# EAGLE schematic keyboard Right (EAGLE 6.6.0)
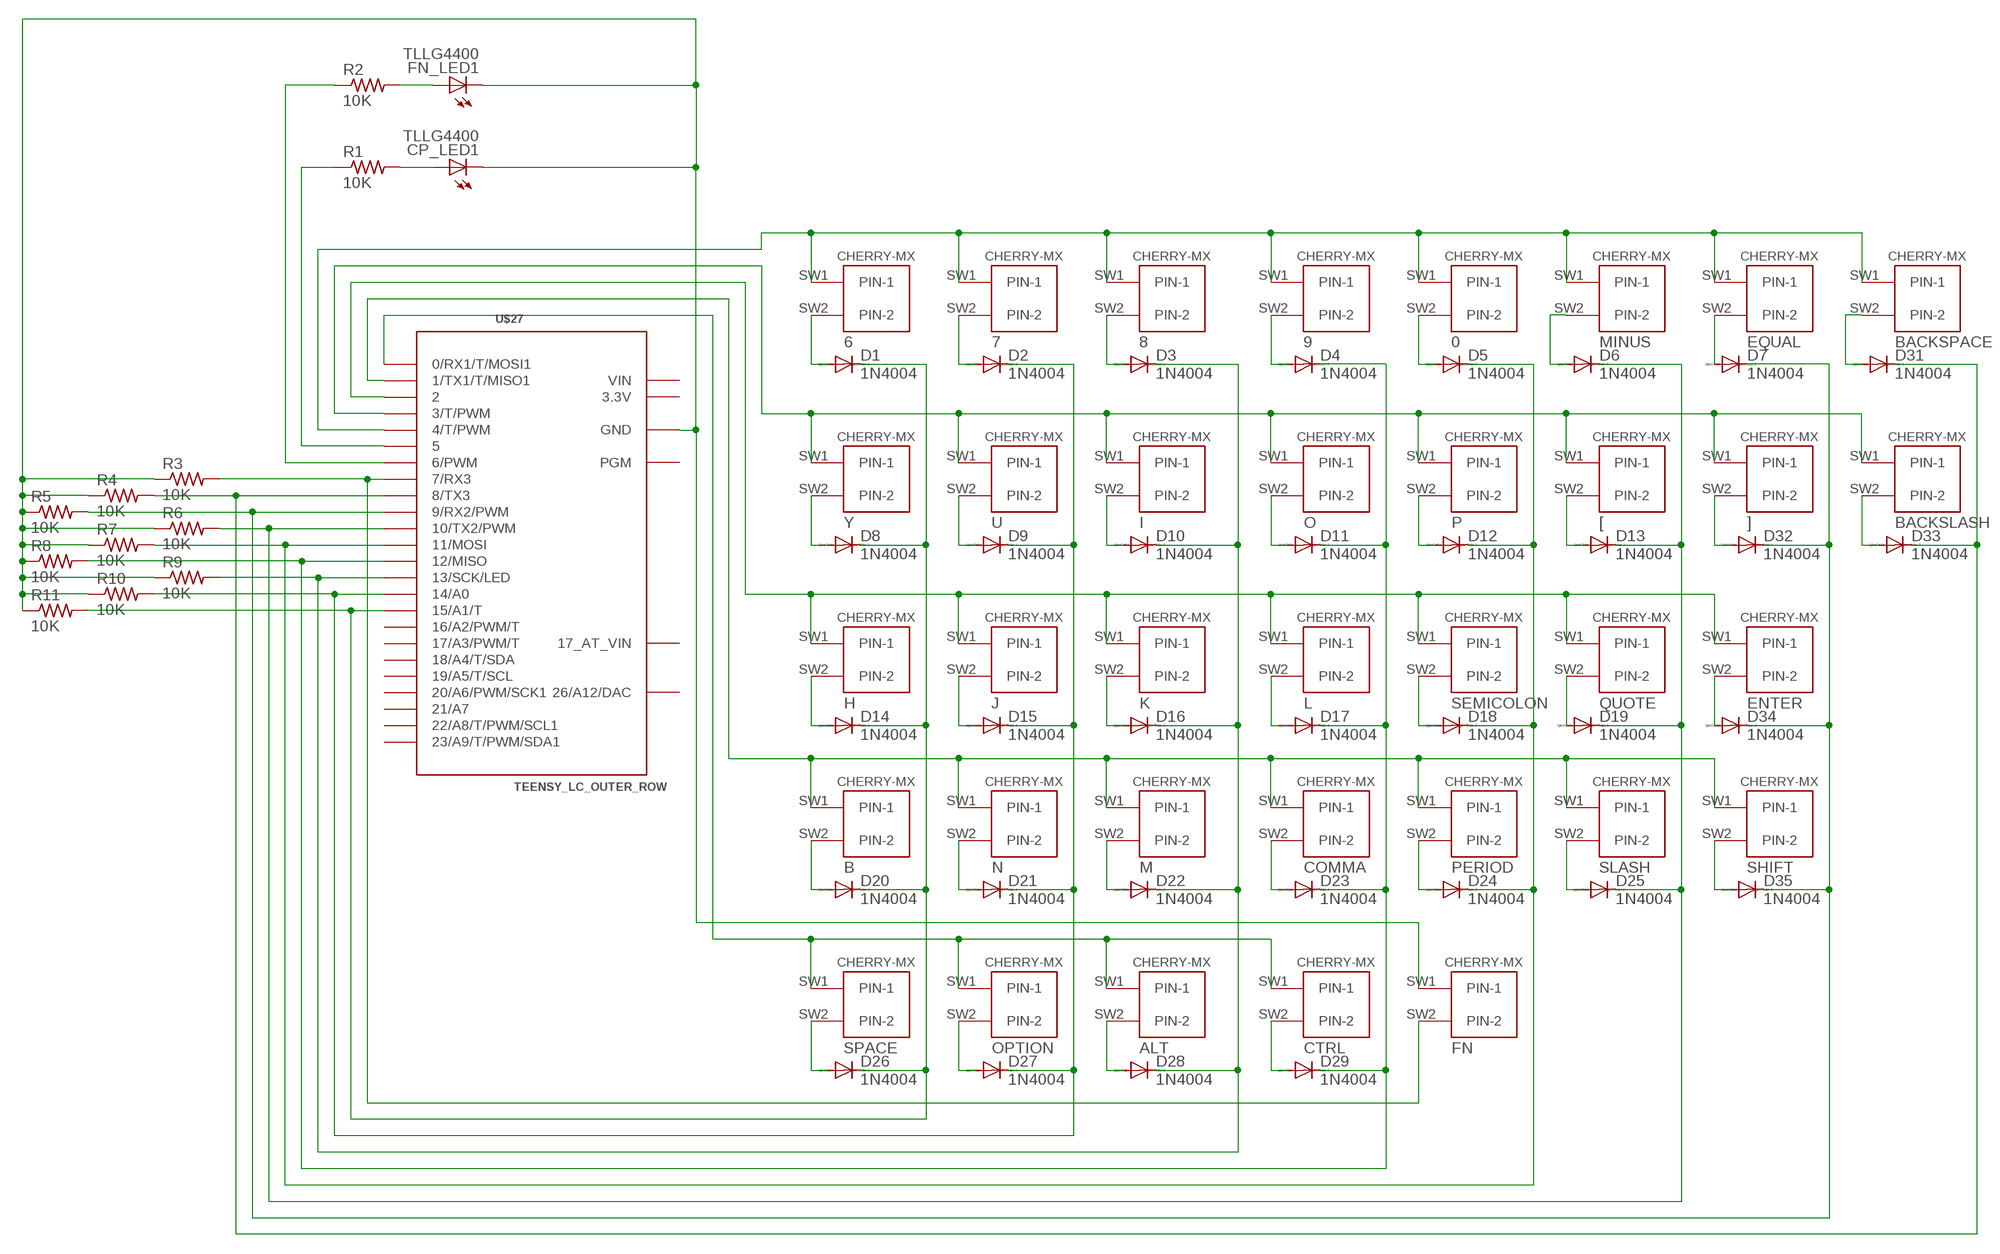
[diagram p0: schematic, sheet 1]

## Parts
0  CHERRY-MX  [CHERRY-MX]
6  CHERRY-MX  [CHERRY-MX]
7  CHERRY-MX  [CHERRY-MX]
8  CHERRY-MX  [CHERRY-MX]
9  CHERRY-MX  [CHERRY-MX]
[  CHERRY-MX  [CHERRY-MX]
]  CHERRY-MX  [CHERRY-MX]
ALT  CHERRY-MX  [CHERRY-MX]
B  CHERRY-MX  [CHERRY-MX]
BACKSLASH  CHERRY-MX  [CHERRY-MX]
BACKSPACE  CHERRY-MX  [CHERRY-MX]
COMMA  CHERRY-MX  [CHERRY-MX]
CP_LED1  TLLG4400  [LED3MM]
CTRL  CHERRY-MX  [CHERRY-MX]
D1  1N4004  [DO41-10]
D2  1N4004  [DO41-10]
D3  1N4004  [DO41-10]
D4  1N4004  [DO41-10]
D5  1N4004  [DO41-10]
D6  1N4004  [DO41-10]
D7  1N4004  [DO41-10]
D8  1N4004  [DO41-10]
D9  1N4004  [DO41-10]
D10  1N4004  [DO41-10]
D11  1N4004  [DO41-10]
D12  1N4004  [DO41-10]
D13  1N4004  [DO41-10]
D14  1N4004  [DO41-10]
D15  1N4004  [DO41-10]
D16  1N4004  [DO41-10]
D17  1N4004  [DO41-10]
D18  1N4004  [DO41-10]
D19  1N4004  [DO41-10]
D20  1N4004  [DO41-10]
D21  1N4004  [DO41-10]
D22  1N4004  [DO41-10]
D23  1N4004  [DO41-10]
D24  1N4004  [DO41-10]
D25  1N4004  [DO41-10]
D26  1N4004  [DO41-10]
D27  1N4004  [DO41-10]
D28  1N4004  [DO41-10]
D29  1N4004  [DO41-10]
D31  1N4004  [DO41-10]
D32  1N4004  [DO41-10]
D33  1N4004  [DO41-10]
D34  1N4004  [DO41-10]
D35  1N4004  [DO41-10]
ENTER  CHERRY-MX  [CHERRY-MX]
EQUAL  CHERRY-MX  [CHERRY-MX]
FN  CHERRY-MX  [CHERRY-MX]
FN_LED1  TLLG4400  [LED3MM]
H  CHERRY-MX  [CHERRY-MX]
I  CHERRY-MX  [CHERRY-MX]
J  CHERRY-MX  [CHERRY-MX]
K  CHERRY-MX  [CHERRY-MX]
L  CHERRY-MX  [CHERRY-MX]
M  CHERRY-MX  [CHERRY-MX]
MINUS  CHERRY-MX  [CHERRY-MX]
N  CHERRY-MX  [CHERRY-MX]
O  CHERRY-MX  [CHERRY-MX]
OPTION  CHERRY-MX  [CHERRY-MX]
P  CHERRY-MX  [CHERRY-MX]
PERIOD  CHERRY-MX  [CHERRY-MX]
QUOTE  CHERRY-MX  [CHERRY-MX]
R1  10K  R-US_0204/7  [0204/7]
R2  10K  R-US_0204/7  [0204/7]
R3  10K  R-US_0204/7  [0204/7]
R4  10K  R-US_0204/7  [0204/7]
R5  10K  R-US_0204/7  [0204/7]
R6  10K  R-US_0204/7  [0204/7]
R7  10K  R-US_0204/7  [0204/7]
R8  10K  R-US_0204/7  [0204/7]
R9  10K  R-US_0204/7  [0204/7]
R10  10K  R-US_0204/7  [0204/7]
R11  10K  R-US_0204/7  [0204/7]
SEMICOLON  CHERRY-MX  [CHERRY-MX]
SHIFT  CHERRY-MX  [CHERRY-MX]
SLASH  CHERRY-MX  [CHERRY-MX]
SPACE  CHERRY-MX  [CHERRY-MX]
U  CHERRY-MX  [CHERRY-MX]
U$27  TEENSY_LC_OUTER_ROW  [TEENSY_3.0-3.2&LC_OUTER_ROW]
Y  CHERRY-MX  [CHERRY-MX]

## Nets
N$1: ALT.SW1(PIN-1) CTRL.SW1(PIN-1) OPTION.SW1(PIN-1) SPACE.SW1(PIN-1) U$27.0(0/RX1/T/MOSI1)
N$2: B.SW1(PIN-1) COMMA.SW1(PIN-1) M.SW1(PIN-1) N.SW1(PIN-1) PERIOD.SW1(PIN-1) SHIFT.SW1(PIN-1) SLASH.SW1(PIN-1) U$27.1(1/TX1/T/MISO1)
N$3: D9.A U.SW2(PIN-2)
N$4: 0.SW1(PIN-1) 6.SW1(PIN-1) 7.SW1(PIN-1) 8.SW1(PIN-1) 9.SW1(PIN-1) BACKSPACE.SW1(PIN-1) EQUAL.SW1(PIN-1) MINUS.SW1(PIN-1) U$27.4(4/T/PWM)
N$5: 6.SW2(PIN-2) D1.A
N$7: D8.A Y.SW2(PIN-2)
N$8: 7.SW2(PIN-2) D2.A
N$9: 8.SW2(PIN-2) D3.A
N$10: 9.SW2(PIN-2) D4.A
N$11: 0.SW2(PIN-2) D5.A
N$12: D6.A MINUS.SW2(PIN-2)
N$13: [.SW1(PIN-1) ].SW1(PIN-1) BACKSLASH.SW1(PIN-1) I.SW1(PIN-1) O.SW1(PIN-1) P.SW1(PIN-1) U$27.3(3/T/PWM) U.SW1(PIN-1) Y.SW1(PIN-1)
N$14: ENTER.SW1(PIN-1) H.SW1(PIN-1) J.SW1(PIN-1) K.SW1(PIN-1) L.SW1(PIN-1) QUOTE.SW1(PIN-1) SEMICOLON.SW1(PIN-1) U$27.2
N$15: D10.A I.SW2(PIN-2)
N$16: D11.A O.SW2(PIN-2)
N$17: D12.A P.SW2(PIN-2)
N$18: [.SW2(PIN-2) D13.A
N$19: D7.A EQUAL.SW2(PIN-2)
N$20: D14.A H.SW2(PIN-2)
N$21: FN.SW2(PIN-2) R3.2 U$27.7(7/RX3)
N$22: D15.A J.SW2(PIN-2)
N$23: B.SW2(PIN-2) D20.A
N$24: D26.A SPACE.SW2(PIN-2)
N$25: FN_LED1.A R2.2
N$26: D21.A N.SW2(PIN-2)
N$27: D27.A OPTION.SW2(PIN-2)
N$28: D16.A K.SW2(PIN-2)
N$29: D22.A M.SW2(PIN-2)
N$30: ALT.SW2(PIN-2) D28.A
N$31: D6.C D13.C D19.C D25.C R6.2 U$27.10(10/TX2/PWM)
N$32: D17.A L.SW2(PIN-2)
N$33: COMMA.SW2(PIN-2) D23.A
N$34: CTRL.SW2(PIN-2) D29.A
N$35: CP_LED1.K(C) FN.SW1(PIN-1) FN_LED1.K(C) R3.1 R4.1 R5.1 R6.1 R7.1 R8.1 R9.1 R10.1 R11.1 U$27.AGND(GND) U$27.GND U$27.GND1(GND)
N$36: D5.C D12.C D18.C D24.C R7.2 U$27.11(11/MOSI)
N$37: D18.A SEMICOLON.SW2(PIN-2)
N$38: D19.A QUOTE.SW2(PIN-2)
N$39: D24.A PERIOD.SW2(PIN-2)
N$40: D25.A SLASH.SW2(PIN-2)
N$41: D4.C D11.C D17.C D23.C D29.C R8.2 U$27.12(12/MISO)
N$42: R1.1 U$27.5
N$43: CP_LED1.A R1.2
N$47: BACKSPACE.SW2(PIN-2) D31.A
N$48: D7.C D32.C D34.C D35.C R5.2 U$27.9(9/RX2/PWM)
N$49: D3.C D10.C D16.C D22.C D28.C R9.2 U$27.13(13/SCK/LED)
N$51: ].SW2(PIN-2) D32.A
N$54: BACKSLASH.SW2(PIN-2) D33.A
N$55: D31.C D33.C R4.2 U$27.8(8/TX3)
N$57: R2.1 U$27.6(6/PWM)
N$58: D34.A ENTER.SW2(PIN-2)
N$61: D35.A SHIFT.SW2(PIN-2)
N$62: D1.C D8.C D14.C D20.C D26.C R11.2 U$27.15/A1(15/A1/T)
OPTION: D2.C D9.C D15.C D21.C D27.C R10.2 U$27.14/A0
Unconnected: U$27.16/A2(16/A2/PWM/T) U$27.17/A3(17/A3/PWM/T) U$27.18/A4(18/A4/T/SDA) U$27.19/A5(19/A5/T/SCL) U$27.20/A6(20/A6/PWM/SCK1) U$27.21/A7 U$27.22/A8(22/A8/T/PWM/SCL1) U$27.23/A9(23/A9/T/PWM/SDA1) U$27.PGM U$27.VBAT(17_AT_VIN)

## Power pins joined to a net without a drawn wire
3.3V: U$27.3.3V U$27.3.3V1(3.3V)
26/A12/DAC: U$27.RESET/DAC(26/A12/DAC)
VIN: U$27.VIN

## Library data of the parts
0 6-9 [ ] ALT B BACKSLASH BACKSPACE COMMA CTRL ENTER EQUAL FN H I J K L M MINUS N O OPTION P PERIOD QUOTE SEMICOLON SHIFT SLASH SPACE U Y = cherrymx:CHERRY-MX: Cherry MX series keyswitch
CP_LED1 FN_LED1 = led:TLLG4400: Low Current (2mA) LED 3 mm Tinted Diffused Package color GREEN Source: Data sheet <http://www.farnell.com/datasheets/391098.pdf>; MF: VISHAY SEMICONDUCTOR; OC_FARNELL: 1612435
D1-D29 D31-D35 = diode:1N4004: DIODE general purpose rectifier, 1 A
R1-R11 = resistor:R-US_: RESISTOR, American symbol
U$27 = Teensy_3_and_LC_Series_Boards_v1.4:TEENSY_LC_OUTER_ROW: Teensy LC with only outer row of pins.